# Altium schematic sheet CAN_Switch.SchDoc
size A4; SheetNumber: 8; SheetTotal: 13
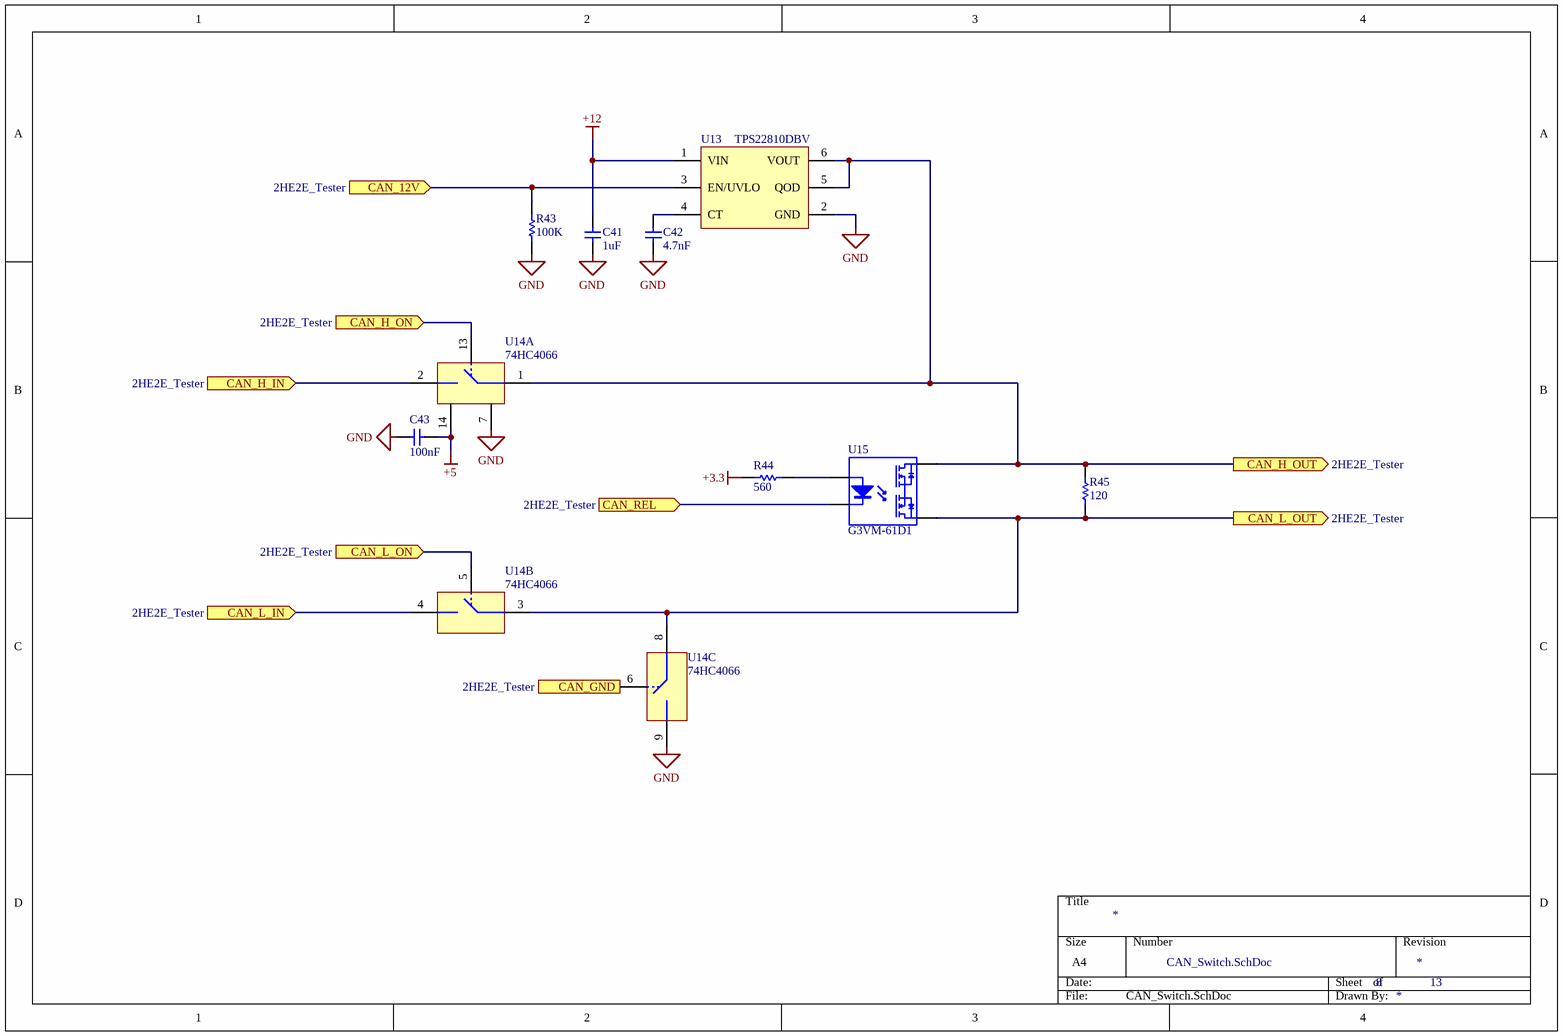
[diagram p0: CAN_Switch.SchDoc]

## Parts
C41  value 1uF  [0603M-C]  (hidden comment: Cap Ceramic)
C42  value 4.7nF  [0603M-C]  (hidden comment: Cap Ceramic)
C43  value 100nF  [0603M-C]  (hidden comment: Cap Ceramic)
R43  value 100K  [0603M]  (hidden comment: Resistor)
R44  value 560  [0603M]  (hidden comment: Resistor)
R45  value 120  [0603M]  (hidden comment: Resistor)
U13  TPS22810DBV  [SOT23-6 (SOT26)]
U14  74HC4066  [SOIC127P600X175-14N-Medium Density]  (parts A,B,C of 4)
U15  G3VM-61D1  [G3VM-351D]

## Ports
CAN_12V (in, see 2HE2E_Tester), CAN_GND (in, see 2HE2E_Tester), CAN_H_IN (in, see 2HE2E_Tester), CAN_H_ON (in, see 2HE2E_Tester), CAN_H_OUT (out, see 2HE2E_Tester), CAN_L_IN (in, see 2HE2E_Tester), CAN_L_ON (in, see 2HE2E_Tester), CAN_L_OUT (out, see 2HE2E_Tester), CAN_REL (in, see 2HE2E_Tester)

## Nets
+3.3: R44.2
+5: C43.2 U14.14(VCC)
+12: C41.1 U13.1(VIN)
GND: C41.2 C42.2 C43.1 R43.1 U13.2(GND) U14.7(GND) U14.9
CAN_12V: R43.2 U13.3(EN/UVLO) ; port CAN_12V
CAN_GND: U14.6 ; port CAN_GND
CAN_H_IN: U14.2 ; port CAN_H_IN
CAN_H_ON: U14.13 ; port CAN_H_ON
CAN_H_OUT: R45.2 U13.5(QOD) U13.6(VOUT) U14.1 U15.4(MOS+) ; port CAN_H_OUT
CAN_L_IN: U14.4 ; port CAN_L_IN
CAN_L_ON: U14.5 ; port CAN_L_ON
CAN_L_OUT: R45.1 U14.3 U14.8 U15.3(MOS-) ; port CAN_L_OUT
CAN_REL: U15.2(K) ; port CAN_REL
NetC42_1: C42.1 U13.4(CT)
NetR44_1: R44.1 U15.1(A)

## Notes on the sheet
- Title
- Size:
- Date:
- A4
- Number:
- Time:
- Revision:
- Sheet
- of
- File:

## Library data of the parts
C41 = Cap Ceramic: Ceramic Capacitor 16V
C42 C43 = Cap Ceramic: Ceramic Capacitor
U13 = TPS22810DBV: Load Switch With Thermal Protection 2.7-18-V, 79-mΩ On-Resistance
U14 = 74HC4066: Quad bilateral switch
U15 = FotoMOS: FotoMOS FET Relays